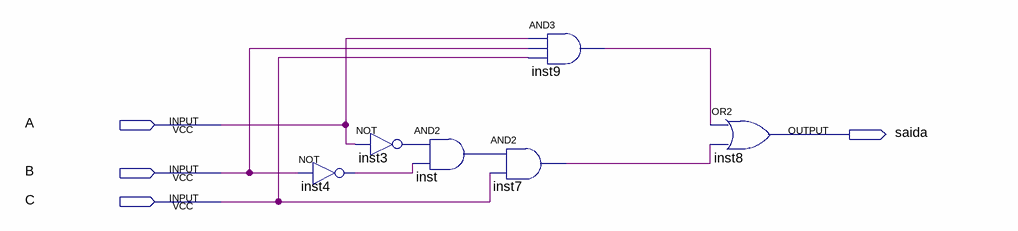
[diagram p0: schematic sheet]
// Quartus schematic Cicuito_Igualdade1bit.bdf as structural Verilog: 6 symbols, 4 pins
module Cicuito_Igualdade1bit (
  input  A,
  input  B,
  input  C,
  output saida
);

  wire inst3_out, inst4_out, inst7_out, inst9_out, inst_out;

  not inst3 (inst3_out, A);
  not inst4 (inst4_out, B);
  and inst (inst_out, inst3_out, inst4_out);
  and inst7 (inst7_out, inst_out, C);
  and inst9 (inst9_out, A, B, C);
  or inst8 (saida, inst9_out, inst7_out);
endmodule
